# EAGLE design dc25-darknet-dialer (EAGLE 7.7.0)
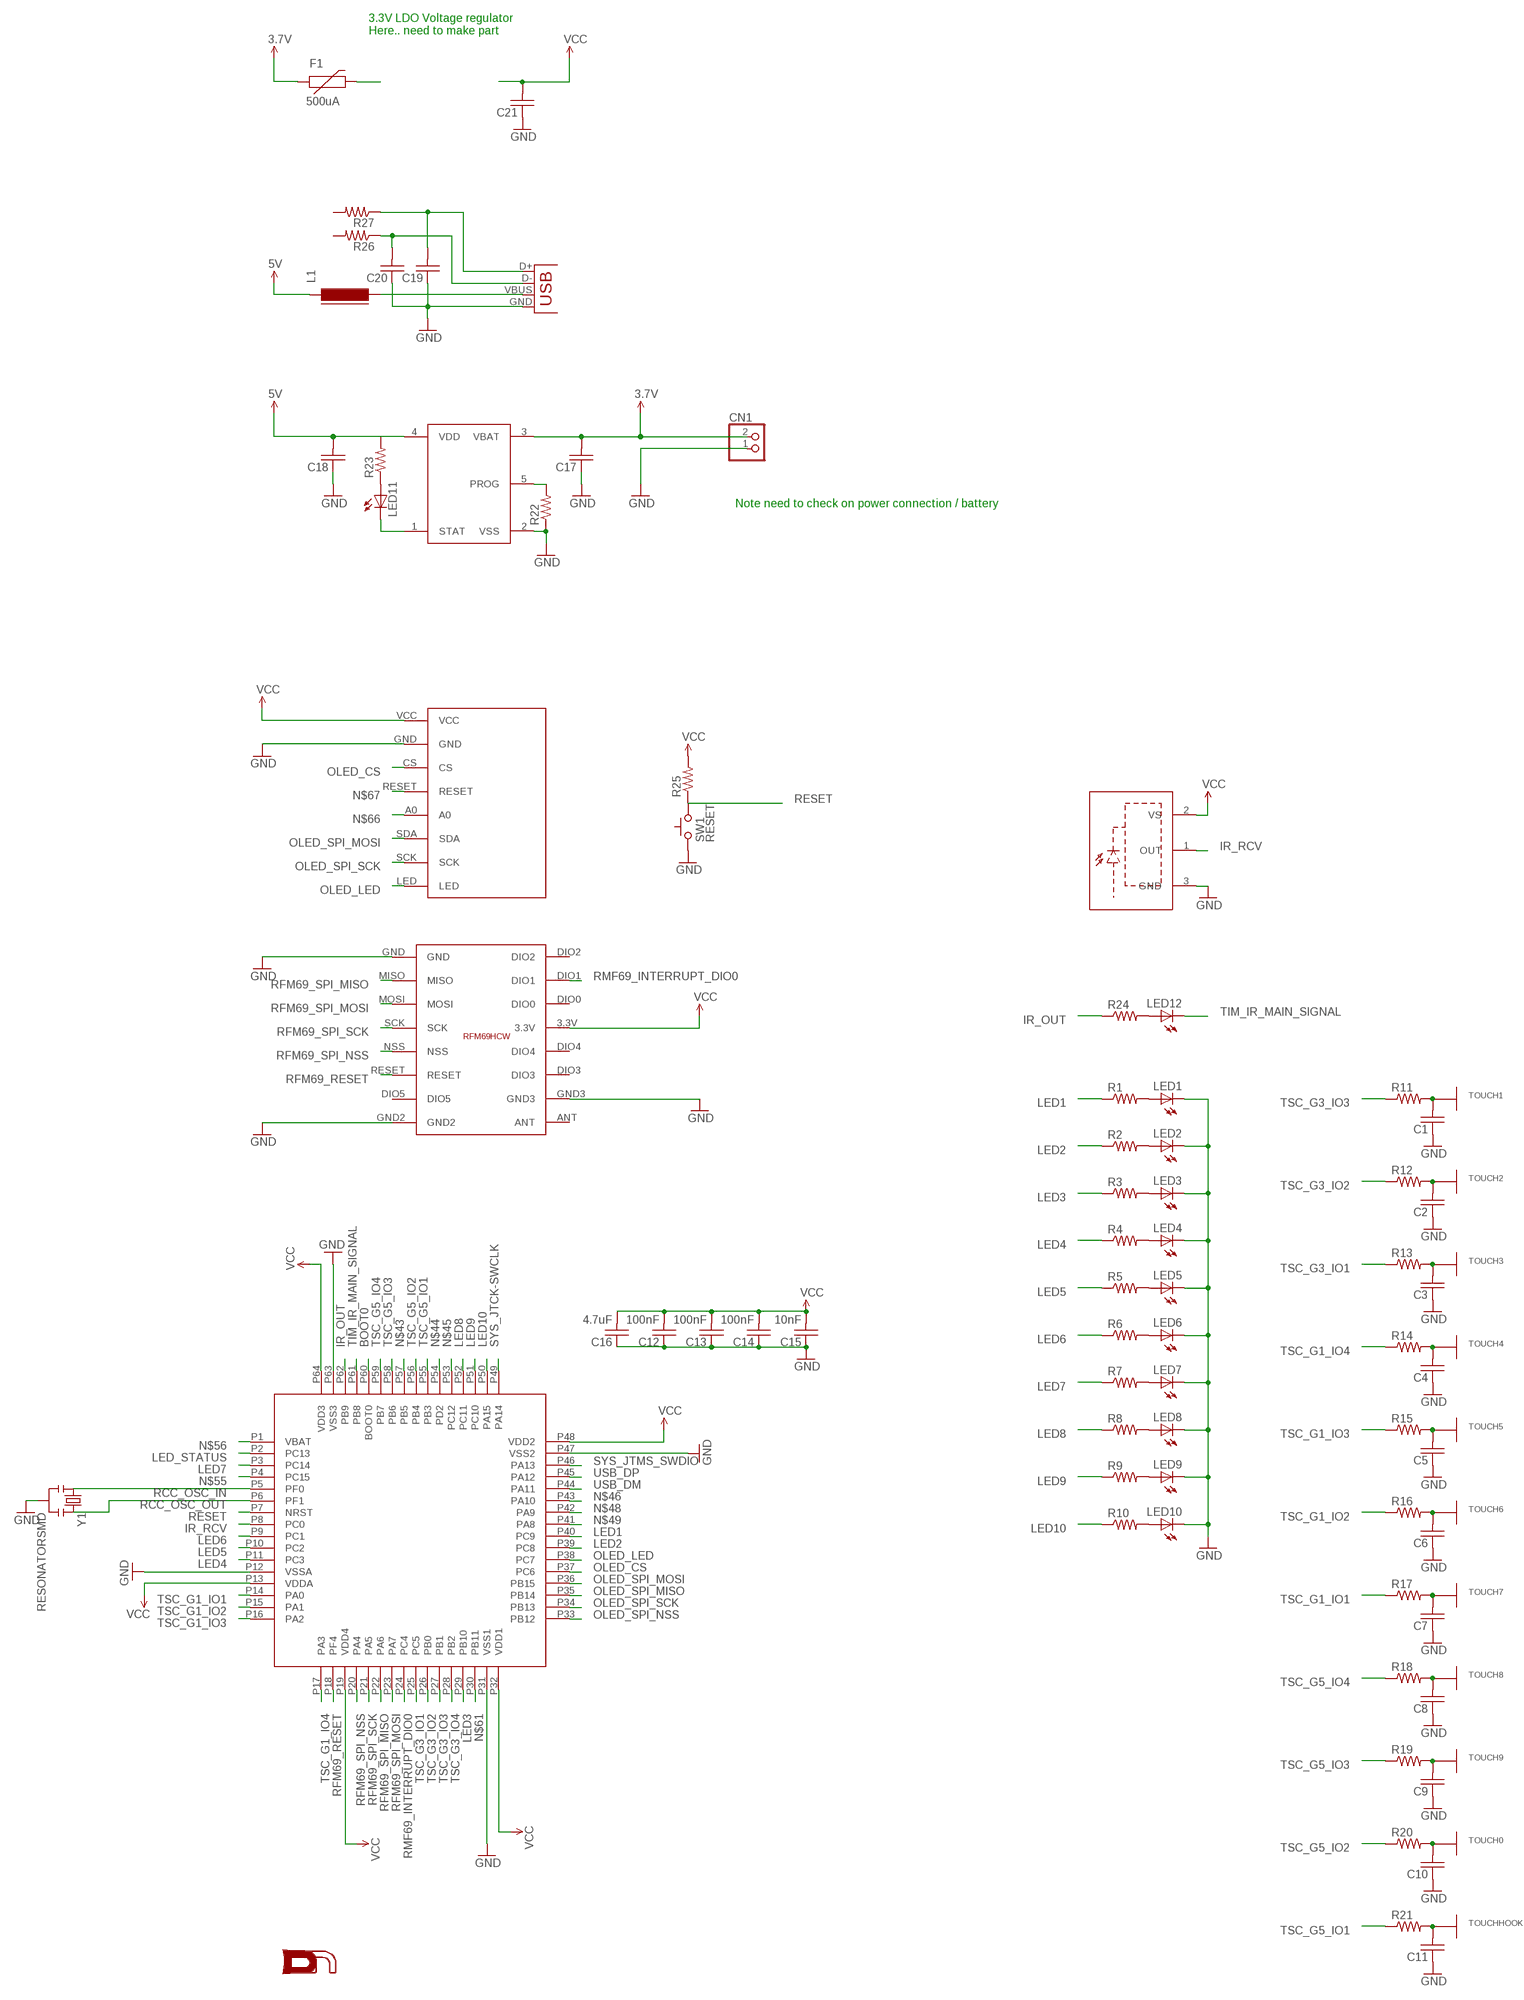
[diagram p0: schematic, sheet 1]

## Parts
C1  C-USC0603  [C0603]
C2  C-USC0603  [C0603]
C3  C-USC0603  [C0603]
C4  C-USC0603  [C0603]
C5  C-USC0603  [C0603]
C6  C-USC0603  [C0603]
C7  C-USC0603  [C0603]
C8  C-USC0603  [C0603]
C9  C-USC0603  [C0603]
C10  C-USC0603  [C0603]
C11  C-USC0603  [C0603]
C12  100nF  C-USC0603  [C0603]
C13  100nF  C-USC0603  [C0603]
C14  100nF  C-USC0603  [C0603]
C15  10nF  C-USC0603  [C0603]
C16  4.7uF  C-USC0603  [C0603]
C17  C-USC0603  [C0603]
C18  C-USC0603  [C0603]
C19  C-USC0603  [C0603]
C20  C-USC0603  [C0603]
C21  C-USC0603  [C0603]
CN1  JST_2PIN-THM-RA  [JST-PH-2-THM-RA]
F1  500uA  PTCSMD  [PTC-1206]
L1  FERRITE-0603  [FB603]
LED1  LEDREVERSEMOUNT  [GULLWING_LED]
LED2  LEDREVERSEMOUNT  [GULLWING_LED]
LED3  LEDREVERSEMOUNT  [GULLWING_LED]
LED4  LEDREVERSEMOUNT  [GULLWING_LED]
LED5  LEDREVERSEMOUNT  [GULLWING_LED]
LED6  LEDREVERSEMOUNT  [GULLWING_LED]
LED7  LEDREVERSEMOUNT  [GULLWING_LED]
LED8  LEDREVERSEMOUNT  [GULLWING_LED]
LED9  LEDREVERSEMOUNT  [GULLWING_LED]
LED10  LEDREVERSEMOUNT  [GULLWING_LED]
LED11  LED0603  [LED-0603]
LED12  LED5MM  [LED5MM]
R1  RESISTOR1206  [1206]
R2  RESISTOR1206  [1206]
R3  RESISTOR1206  [1206]
R4  RESISTOR1206  [1206]
R5  RESISTOR1206  [1206]
R6  RESISTOR1206  [1206]
R7  RESISTOR1206  [1206]
R8  RESISTOR1206  [1206]
R9  RESISTOR1206  [1206]
R10  RESISTOR1206  [1206]
R11  R-US_R0603  [R0603]
R12  R-US_R0603  [R0603]
R13  R-US_R0603  [R0603]
R14  R-US_R0603  [R0603]
R15  R-US_R0603  [R0603]
R16  R-US_R0603  [R0603]
R17  R-US_R0603  [R0603]
R18  R-US_R0603  [R0603]
R19  R-US_R0603  [R0603]
R20  R-US_R0603  [R0603]
R21  R-US_R0603  [R0603]
R22  R-US_R0603  [R0603]
R23  R-US_R0603  [R0603]
R24  R-US_0309/12  [0309/12]
R25  R-US_0309/12  [0309/12]
R26  R-US_R0603  [R0603]
R27  R-US_R0603  [R0603]
SW1  RESET  SWITCH_TACTILETACTILE-2PIN-NARROW  [TACTILE-2PIN-NARROW]
TOUCH0  CAP_TOUCH0  [CAP_TOUCH_PAD_0]
TOUCH1  CAP_TOUCH1  [CAP_TOUCH_PAD_1]
TOUCH2  CAP_TOUCH2  [CAP_TOUCH_PAD_2]
TOUCH3  CAP_TOUCH3  [CAP_TOUCH_PAD_3]
TOUCH4  CAP_TOUCH4  [CAP_TOUCH_PAD_4]
TOUCH5  CAP_TOUCH5  [CAP_TOUCH_PAD_5]
TOUCH6  CAP_TOUCH6  [CAP_TOUCH_PAD_6]
TOUCH7  CAP_TOUCH7  [CAP_TOUCH_PAD_7]
TOUCH8  CAP_TOUCH8  [CAP_TOUCH_PAD_8]
TOUCH9  CAP_TOUCH9  [CAP_TOUCH_PAD_9]
TOUCHHOOK  CAP_TOUCHHOOK  [CAP_TOUCH_PAD_HOOK]
U$1  DN_LOGO  [DN_LOGO]
U$2  STM32F302XC  [LQFP64]
U$11  DS21984E  [SOT23-5]
U$12  COLOR_LCD_MODULE  [COLOR_LCD_DISPLAY]
U$15  RFM69HCWRFN69HCWSMD  [16PIN-PCB-SMD]
U$17  SOP22  [IR-MODULE]
X1  USB-MICROB  [USB-MICROB]
Y1  RESONATORSMD  [RESONATOR-SMD]

## Nets
BOOT0: U$2.P60(BOOT0)
GND: C1.1 C2.1 C3.1 C4.1 C5.1 C6.1 C7.1 C8.1 C9.1 C10.1 C11.1 C12.1 C13.1 C14.1 C15.1 C16.1 C17.1 C18.1 C19.1 C20.1 C21.1 CN1.1 LED1.C LED2.C LED3.C LED4.C LED5.C LED6.C LED7.C LED8.C LED9.C LED10.C R22.1 SW1.P$2(C) U$2.P12(VSSA) U$2.P31(VSS1) U$2.P47(VSS2) U$2.P63(VSS3) U$11.2(VSS) U$12.GND U$15.GND U$15.GND2 U$15.GND3 U$17.3(GND) X1.GND Y1.2
IR_OUT: R24.1 U$2.P62(PB9)
IR_RCV: U$2.P8(PC0) U$17.1(OUT)
LED1: R1.1 U$2.P40(PC9)
LED2: R2.1 U$2.P39(PC8)
LED3: R3.1 U$2.P29(PB10)
LED4: R4.1 U$2.P11(PC3)
LED5: R5.1 U$2.P10(PC2)
LED6: R6.1 U$2.P9(PC1)
LED7: R7.1 U$2.P3(PC14)
LED8: R8.1 U$2.P52(PC11)
LED9: R9.1 U$2.P51(PC10)
LED10: R10.1 U$2.P50(PA15)
LED_STATUS: U$2.P2(PC13)
N$1: C1.2 R11.2 TOUCH1.PAD(TOUCH)
N$2: C2.2 R12.2 TOUCH2.PAD(TOUCH)
N$3: C3.2 R13.2 TOUCH3.PAD(TOUCH)
N$4: C4.2 R14.2 TOUCH4.PAD(TOUCH)
N$5: C5.2 R15.2 TOUCH5.PAD(TOUCH)
N$6: C6.2 R16.2 TOUCH6.PAD(TOUCH)
N$7: C7.2 R17.2 TOUCH7.PAD(TOUCH)
N$8: C8.2 R18.2 TOUCH8.PAD(TOUCH)
N$9: C9.2 R19.2 TOUCH9.PAD(TOUCH)
N$10: C10.2 R20.2 TOUCH0.PAD(TOUCH)
N$11: C11.2 R21.2 TOUCHHOOK.P$1(TOUCH)
N$12: LED1.A R1.2
N$13: LED2.A R2.2
N$14: LED3.A R3.2
N$15: LED4.A R4.2
N$16: LED5.A R5.2
N$17: LED6.A R6.2
N$18: LED7.A R7.2
N$19: LED8.A R8.2
N$20: LED9.A R9.2
N$21: LED10.A R10.2
N$22: R22.2 U$11.5(PROG)
N$23: LED12.A R24.2
N$24: LED11.A R23.1
N$25: LED11.C U$11.1(STAT)
N$26: C19.2 R27.1 X1.D+
N$27: C20.2 R26.1 X1.D-
N$28: L1.2 X1.VBUS
N$31: F1.2
N$43: U$2.P57(PB5)
N$44: U$2.P54(PD2)
N$45: U$2.P53(PC12)
N$46: U$2.P43(PA10)
N$48: U$2.P42(PA9)
N$49: U$2.P41(PA8)
N$55: U$2.P4(PC15)
N$56: U$2.P1(VBAT)
N$61: U$2.P30(PB11)
N$66: U$12.A0
N$67: U$12.RESET
OLED_CS: U$2.P37(PC6) U$12.CS
OLED_LED: U$2.P38(PC7) U$12.LED
OLED_SPI_MISO: U$2.P35(PB14)
OLED_SPI_MOSI: U$2.P36(PB15) U$12.SDA
OLED_SPI_NSS: U$2.P33(PB12)
OLED_SPI_SCK: U$2.P34(PB13) U$12.SCK
RCC_OSC_IN: U$2.P5(PF0) Y1.1
RCC_OSC_OUT: U$2.P6(PF1) Y1.3
RESET: R25.1 SW1.P$1(A) U$2.P7(NRST)
RFM69_RESET: U$2.P18(PF4) U$15.RESET
RFM69_SPI_MISO: U$2.P22(PA6) U$15.MISO
RFM69_SPI_MOSI: U$2.P23(PA7) U$15.MOSI
RFM69_SPI_NSS: U$2.P20(PA4) U$15.NSS
RFM69_SPI_SCK: U$2.P21(PA5) U$15.SCK
RMF69_INTERRUPT_DIO0: U$2.P24(PC4) U$15.DIO1
SYS_JTCK-SWCLK: U$2.P49(PA14)
SYS_JTMS_SWDIO: U$2.P46(PA13)
TIM_IR_MAIN_SIGNAL: LED12.K(C) U$2.P61(PB8)
TSC_G1_IO1: R17.1 U$2.P14(PA0)
TSC_G1_IO2: R16.1 U$2.P15(PA1)
TSC_G1_IO3: R15.1 U$2.P16(PA2)
TSC_G1_IO4: R14.1 U$2.P17(PA3)
TSC_G3_IO1: R13.1 U$2.P25(PC5)
TSC_G3_IO2: R12.1 U$2.P26(PB0)
TSC_G3_IO3: R11.1 U$2.P27(PB1)
TSC_G3_IO4: U$2.P28(PB2)
TSC_G5_IO1: R21.1 U$2.P55(PB3)
TSC_G5_IO2: R20.1 U$2.P56(PB4)
TSC_G5_IO3: R19.1 U$2.P58(PB6)
TSC_G5_IO4: R18.1 U$2.P59(PB7)
USB_DM: U$2.P44(PA11)
USB_DP: U$2.P45(PA12)
VCC: C12.2 C13.2 C14.2 C15.2 C16.2 C21.2 R25.2 U$2.P13(VDDA) U$2.P19(VDD4) U$2.P32(VDD1) U$2.P48(VDD2) U$2.P64(VDD3) U$12.VCC U$15.3.3V U$17.2(VS)
VCC0: C18.2 L1.1 R23.2 U$11.4(VDD) ; supply symbol labelled 5V
VCC1: C17.2 CN1.2 F1.1 U$11.3(VBAT) ; supply symbol labelled 3.7V
Unconnected: R26.2 R27.2 U$15.ANT U$15.DIO0 U$15.DIO2 U$15.DIO3 U$15.DIO4 U$15.DIO5

## Notes on the sheet
- 3.3V LDO Voltage regulator
  Here.. need to make part
- Note need to check on power connection / battery

## Library data of the parts
C1-C21 = SYNShop:C-US: CAPACITOR, American symbol
CN1 = adafruit:JST_2PIN: JST 2-Pin Connectors of various flavors SMT-RA (S2B-PH-SM4) 4UConnector #17311 SMT (B2B-PH-SM4) THM-RA (S2B-PH) THM (B2B-PH)
F1 = SparkFun:PTC: Resettable Fuse PTC Resettable Fuse. Spark Fun Electronics SKU : COM-08357
L1 = dp_devices:FERRITE: Ferrite bead in various packages
LED1-LED12 = SYNShop:LED: LEDs Standard schematic elements and footprints for 5mm, 3mm, 1206, and 0603 sized LEDs. 5mm - Spark Fun Electronics SKU : COM-00529 (and others)
R1-R10 = SYNShop:RESISTOR: Resistor Basic schematic elements and footprints for 0603, 1206, and PTH resistors.
R11-R27 = SYNShop:R-US_: RESISTOR, American symbol
SW1 = SYNShop:SWITCH_TACTILE
TOUCH0 TOUCH1-TOUCH9 TOUCHHOOK = darknet_parts_library:CAP_TOUCH
U$1 = SYNShop:DN_LOGO
U$2 = darknet_parts_library:STM32F302XC
U$11 = darknet_parts_library:DS21984E
U$12 = darknet_parts_library:COLOR_LCD_MODULE
U$15 = SYNShop:RFM69HCW
U$17 = SYNShop:SOP22
X1 = SYNShop:USB: USB Connectors USB-B-PTH is fully proven SKU : PRT-00139 USB-miniB is fully proven SKU : PRT-00587 USB-A-PCB is untested. USB-A-H is throughly reviewed, but untested. Spark Fun Electronics SKU : PRT-00437 USB-B-SMT is throughly reviewed, but untested. Needs silkscreen touching up. USB-A-S has not been used/tested USB-MB-H has not been used/tested
Y1 = SparkFun:RESONATOR: Resonator Small SMD resonator. This is the itty bitty 10/20MHz resonators with built in caps. CSTCE10M0G55 and CSTCE20M0V53. Footprint has been reviewed closely but hasn't been tested yet.

## Board
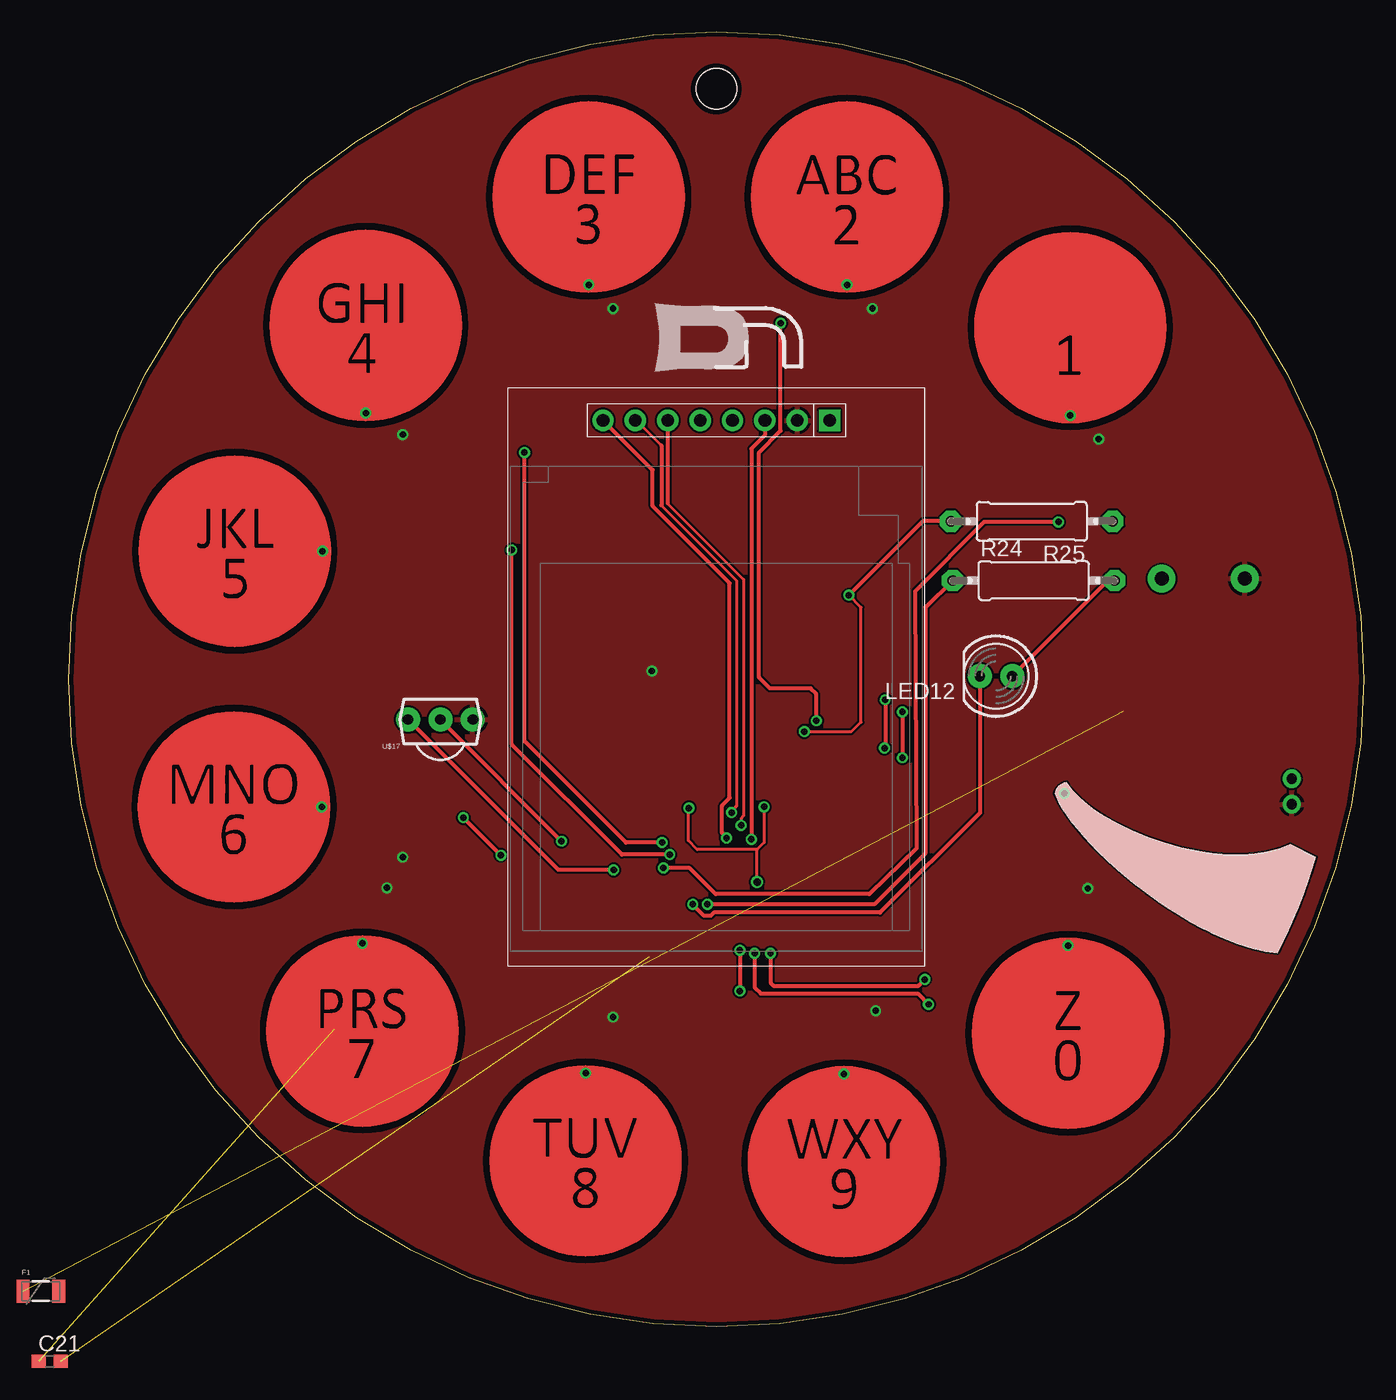
[diagram p1: board, top side]
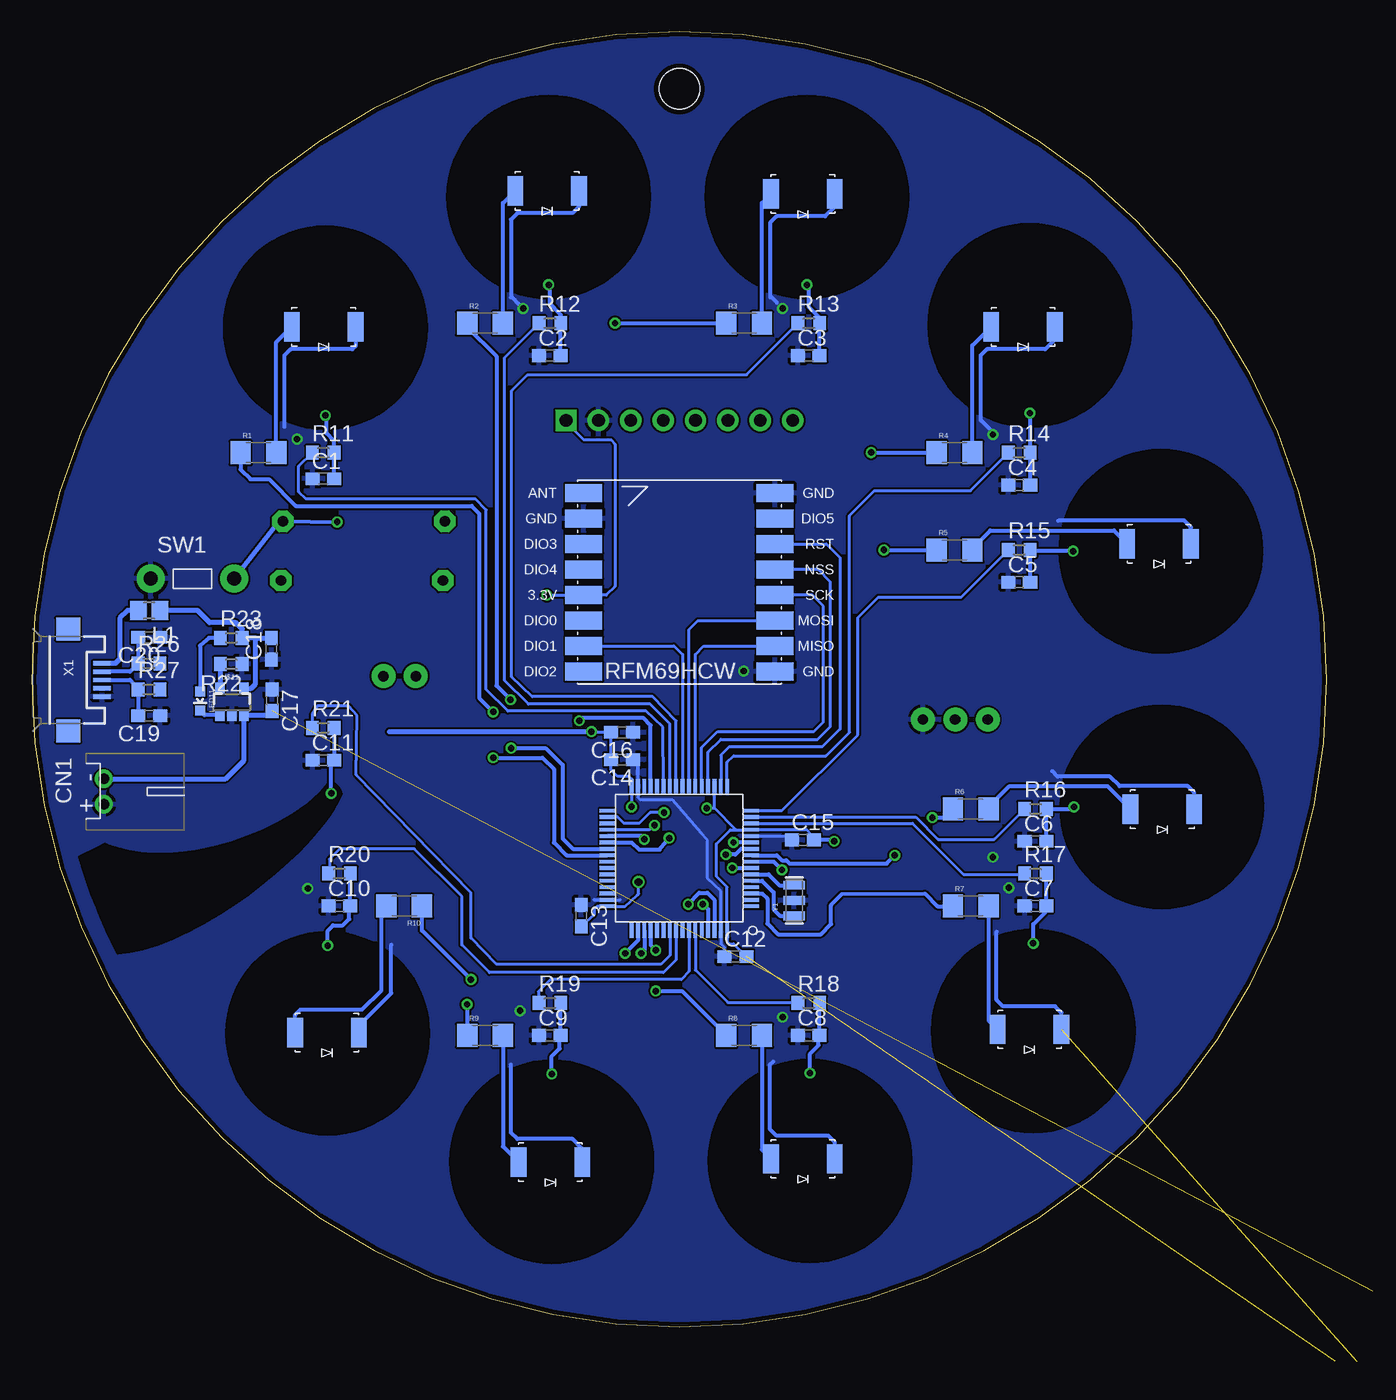
[diagram p2: board, bottom side, seen from below]

Size 101.6 x 101.6 mm. Coordinates in mm from the lower left corner, seen from the top.
Outline: 50.8,101.6 arc-180 50.8,0 arc-180 50.8,101.6
Copper layers (1*16): Top 0.0356mm / dielectric 1.5011mm / Bottom 0.0356mm
Design rules "oshpark-2layer": minimum track width 6mil, minimum drill 13mil, track to track 6mil, track to pad 6mil, pad to pad 6mil, via to via 6mil, smd to smd 6mil, copper to edge 15mil, drill to drill 6mil, minimum pad ring 7mil, minimum via ring 7mil, stop-mask expansion 2.5mil, vias tented up to drill 0mil, thermal gap 10mil
Holes 3.2 mm at 50.8,97.12

### Footprints (pad centres in the part's own frame; a part is rotated, then mirrored left to right if it is on the bottom)
C0603 = smd 1.1 x 1: 1 -0.85,0; 2 0.85,0
JST-PH-2-THM-RA = drill 0.8 pad 1.422: 1 1,0; 2 -1,0
PTC-1206 = smd 1 x 1.8: 1 -1.4,0; 2 1.4,0
FB603 = smd 1.3 x 1.5: 1 -0.85,0; 2 0.85,0
GULLWING_LED = smd 1.245 x 2.3: A 5,-1.5; C 0,-1.5
LED-0603 = smd 0.8 x 0.8: A 0,-0.75; C 0,0.75
LED5MM = drill 0.813 pad 1.88: A -1.27,0; K 1.27,0
1206 = smd 1.6 x 1.8: 1 -1.4,0; 2 1.4,0
R0603 = smd 1 x 1.1: 1 -0.85,0; 2 0.85,0
0309/12 = drill 0.813 pad 1.676 octagon: 1 -6.35,0; 2 6.35,0
TACTILE-2PIN-NARROW = drill 1.1 pad 2.184: P$1 3.264,0; P$2 -3.264,0
CAP_TOUCH_PAD_0 = drill 0.5: PAD 0,6.881
CAP_TOUCH_PAD_1 = drill 0.5: PAD 0,-6.881
CAP_TOUCH_PAD_2 = drill 0.5: PAD 0,-6.881
CAP_TOUCH_PAD_3 = drill 0.5: PAD 0,-6.881
CAP_TOUCH_PAD_4 = drill 0.5: PAD 0,-6.881
CAP_TOUCH_PAD_5 = drill 0.5: PAD 6.881,0
CAP_TOUCH_PAD_6 = drill 0.5: PAD 6.881,0
CAP_TOUCH_PAD_7 = drill 0.5: PAD 0,6.881
CAP_TOUCH_PAD_8 = drill 0.5: PAD 0,6.881
CAP_TOUCH_PAD_9 = drill 0.5: PAD 0,6.881
CAP_TOUCH_PAD_HOOK = drill 0.5: P$1 -8,6.3
LQFP64 = smd 1.2 x 0.3: P1 -5.65,3.75; P2 -5.65,3.25; P3 -5.65,2.75; P4 -5.65,2.25; P5 -5.65,1.75; P6 -5.65,1.25; P7 -5.65,0.75; P8 -5.65,0.25; P9 -5.65,-0.25; P10 -5.65,-0.75; P11 -5.65,-1.25; P12 -5.65,-1.75; P13 -5.65,-2.25; P14 -5.65,-2.75; P15 -5.65,-3.25; P16 -5.65,-3.75; P33 5.65,-3.75; P34 5.65,-3.25; P35 5.65,-2.75; P36 5.65,-2.25; P37 5.65,-1.75; P38 5.65,-1.25; P39 5.65,-0.75; P40 5.65,-0.25; P41 5.65,0.25; P42 5.65,0.75; P43 5.65,1.25; P44 5.65,1.75; P45 5.65,2.25; P46 5.65,2.75; P47 5.65,3.25; P48 5.65,3.75 | smd 0.3 x 1.2: P17 -3.75,-5.65; P18 -3.25,-5.65; P19 -2.75,-5.65; P20 -2.25,-5.65; P21 -1.75,-5.65; P22 -1.25,-5.65; P23 -0.75,-5.65; P24 -0.25,-5.65; P25 0.25,-5.65; P26 0.75,-5.65; P27 1.25,-5.65; P28 1.75,-5.65; P29 2.25,-5.65; P30 2.75,-5.65; P31 3.25,-5.65; P32 3.75,-5.65; P49 3.75,5.65; P50 3.25,5.65; P51 2.75,5.65; P52 2.25,5.65; P53 1.75,5.65; P54 1.25,5.65; P55 0.75,5.65; P56 0.25,5.65; P57 -0.25,5.65; P58 -0.75,5.65; P59 -1.25,5.65; P60 -1.75,5.65; P61 -2.25,5.65; P62 -2.75,5.65; P63 -3.25,5.65; P64 -3.75,5.65
SOT23-5 = smd 0.75 x 0.9: 1 -0.95,-1; 2 0,-1; 3 0.95,-1; 4 0.95,1.1; 5 -0.95,1.1
COLOR_LCD_DISPLAY = drill 1 pad 1.676: A0 -1.27,0; CS 3.81,0; GND 6.35,0; LED -8.89,0; RESET 1.27,0; SCK -6.35,0; SDA -3.81,0 | drill 1 pad 1.676 square: VCC 8.89,0
16PIN-PCB-SMD = smd 2.9 x 1.422: 3.3V 7.5,1; ANT 7.5,-7; DIO0 7.5,3; DIO1 7.5,5; DIO2 7.5,7; DIO3 7.5,-3; DIO4 7.5,-1; DIO5 -7.5,-5; GND -7.5,7; GND2 -7.5,-7; GND3 7.5,-5; MISO -7.5,5; MOSI -7.5,3; NSS -7.5,-1; RESET -7.5,-3; SCK -7.5,1
IR-MODULE = drill 0.813 pad 1.88: 1 -2.54,0; 2 0,0; 3 2.54,0
USB-MICROB = smd 0.35 x 1.4: D+ 0,2.65; D- -0.65,2.65; GND 1.3,2.65; ID 0.65,2.65; VBUS -1.3,2.65 | smd 1.8 x 1.9: MT1 -4,0; MT2 4,0
RESONATOR-SMD = smd 0.7 x 1.7: 1 -1.2,0; 2 0,0; 3 1.2,0

### Placement (x,y rotation side)
C1  78.74,66.54 0 bottom
C2  60.96,76.2 0 bottom
C3  40.64,76.2 0 bottom
C4  24.13,66.04 0 bottom
C5  24.13,58.42 0 bottom
C6  22.86,38.1 0 bottom
C7  22.86,33.02 0 bottom
C8  40.64,22.86 0 bottom
C9  60.96,22.86 0 bottom
C10  77.47,33.02 0 bottom
C11  78.74,44.45 0 bottom
C12  46.4,29.05 0 bottom
C13  58.5,32.25 270 bottom
C14  55.3,44.5 180 bottom
C15  41.1,38.2 0 bottom
C16  55.3,46.65 180 bottom
C17  82.75,49.15 270 bottom
C18  82.8,53.2 90 bottom
C19  92.4,47.95 180 bottom
C20  92.4,54.1 180 bottom
C21  -1.5,-2.7 0 top
CN1  95.95,42 270 bottom
F1  -2.2,2.8 0 top
L1  92.4,56.2 180 bottom
LED1  76.2,76.96 180 bottom
LED2  58.67,87.63 180 bottom
LED3  38.61,87.38 180 bottom
LED4  21.34,76.96 180 bottom
LED5  10.67,59.94 180 bottom
LED6  10.41,39.12 180 bottom
LED7  20.83,21.84 180 bottom
LED8  38.61,11.68 180 bottom
LED9  58.42,11.43 180 bottom
LED10  75.95,21.59 180 bottom
LED11  88.4,49.1 180 bottom
LED12  72.75,51.05 180 top
R1  83.82,68.58 0 bottom
R2  66.04,78.74 0 bottom
R3  45.72,78.74 0 bottom
R4  29.21,68.58 0 bottom
R5  29.21,60.96 0 bottom
R6  27.94,40.64 0 bottom
R7  27.94,33.02 0 bottom
R8  45.72,22.86 0 bottom
R9  66.04,22.86 0 bottom
R10  72.39,33.02 180 bottom
R11  78.74,68.58 0 bottom
R12  60.96,78.74 0 bottom
R13  40.64,78.74 0 bottom
R14  24.13,68.58 0 bottom
R15  24.13,60.96 0 bottom
R16  22.86,40.64 0 bottom
R17  22.86,35.56 0 bottom
R18  40.64,25.4 0 bottom
R19  60.96,25.4 0 bottom
R20  77.47,35.56 0 bottom
R21  78.74,46.99 0 bottom
R22  85.95,52 180 bottom
R23  85.95,54.05 0 bottom
R24  75.7,58.55 0 top
R25  75.55,63.2 180 top
R26  92.4,52.05 0 bottom
R27  92.4,50 0 bottom
SW1  89,58.7 0 bottom
TOUCH0  78.39,23.03 0 top
TOUCH1  78.57,78.39 0 top
TOUCH2  61.05,88.64 0 top
TOUCH3  40.79,88.64 0 top
TOUCH4  23.3,78.57 0 top
TOUCH5  13.02,60.85 0 top
TOUCH6  12.96,40.79 0 top
TOUCH7  23.03,23.21 0 top
TOUCH8  40.55,13.02 0 top
TOUCH9  60.81,12.96 0 top
TOUCHHOOK  86.11,35.56 0 top
U$1  45.59,75.03 0 top
U$2  50.8,36.75 180 bottom
U$11  85.9,49 0 bottom
U$12  50.8,71.12 0 top
U$15  50.8,58.42 180 bottom
U$17  29.15,47.65 0 top
X1  98.75,50.75 270 bottom
Y1  41.8,33.45 90 bottom

### Tracks (layer width: path | path; a pad name or v marks a point on that pad's centre or on a via)
GND  (via drill 0.5)  (1 unrouted)
  Bottom 0.254: U$2.P47 57.5,33.52 57.5,33.5 55.45,33.5 | U$2.P12 42.1,38.5 C15.1 | 54.05,43.35 U$2.P31 54.05,41.55 53.85,41.35 51.35,41.35 49.1,38.75 48.6,38.2 48.6,35.2 47.55,34.2 U$2.P63 47.55,30.05 47.25,29.75 C12.1
  Bottom 0.305: LED10.C 75.95,23.62 73.41,26.16 73.41,29.97 | LED9.C 58.42,13.97 59.18,14.73 63.5,14.73 64.01,15.24 64.01,20.57 | LED8.C 38.61,14.48 39.12,14.99 43.18,14.99 43.69,15.49 43.69,20.57 43.43,20.83 | LED7.C 20.83,24.64 21.34,25.15 25.4,25.15 25.91,25.65 25.91,30.99 | LED6.C 10.41,41.91 10.92,42.42 16.26,42.42 17.02,43.18 21.13,43.18 21.55,43.6 | LED5.C 10.67,62.74 11.18,63.25 21.08,63.25 | LED4.C 21.34,77.47 22.1,76.71 26.67,76.71 27.18,76.2 27.18,71.12 27.12,71.12 26.35,70.35 | LED3.C 38.61,87.88 39.37,87.12 43.18,87.12 43.69,86.61 43.69,80.77 43.57,80.77 43.15,80.35 | LED2.C 58.67,87.88 59.18,87.38 63.5,87.38 64.01,86.87 64.01,80.77 63.92,80.77 63.4,80.25 | LED1.C 76.2,76.96 76.45,76.71 81.28,76.71 81.79,76.2 81.79,70.61 | 54.05,43.35 54.05,44.1 C14.1
  other vias: 45.75,51.45 26.2,36.85 63.05,79.9 42.7,79.9 26.2,70 24.95,34.45 42.7,24.3 63.3,24.8 79.95,34.4 80.8,69.65
  pour Top: 0,50.8 arc-90 50.8,101.6 arc-90 101.6,50.8 arc-90 50.8,0 arc-90
  pour Bottom: 50.8,101.6 arc90 0,50.8 arc90 50.8,0 arc90 101.6,50.8 arc90
IR_OUT  (via drill 0.5)
  Top 0.305: R24.1 67.2,56.45 67.2,37.15 63.2,33.15 v50.1,33.15
  Bottom 0.305: v50.1,33.15 50.1,33.2 49.25,34.05 48.6,34.05 48.05,33.5 U$2.P62
IR_RCV  (via drill 0.5)
  Top 0.305: v42.75,35.85 38.41,35.85 U$17.1
  Bottom 0.305: U$2.P8 43.4,36.5 v42.75,35.85
LED1  (via drill 0.5)
  Top 0.305: v65.4,48.25 v65.4,44.65
  Bottom 0.305: R1.1 85.22,67.27 84.45,66.5 83,66.5 80.9,64.4 67.1,64.4 66.5,63.8 66.5,49.35 v65.4,48.25 | v65.4,44.65 61.55,44.65 60.65,43.75 60.65,38 59.65,37 U$2.P40
LED2  (via drill 0.5)
  Top 0.305: v64.05,49.2 64.05,45.55 v64,45.4
  Bottom 0.305: R2.1 67.44,78.44 65.15,76.15 65.15,50.3 v64.05,49.2 | v64,45.4 61.3,45.4 59.95,44.1 59.95,38.3 59.15,37.5 U$2.P39
LED3  (via drill 0.5)
  Top 0.305: v58.65,47.55 58.65,49.65 58.2,50.1 55,50.1 54.15,50.95 54.15,68.6 55.85,70.3 v55.85,78.75
  Bottom 0.305: U$2.P29 53.05,47.2 53.6,47.75 58.5,47.75 v58.65,47.55 | v55.85,78.75 R3.1
LED4  (via drill 0.5)
  Top 0.305: v46.55,38 43.7,38 35.75,45.95 v35.75,68.6
  Bottom 0.305: U$2.P11 v46.55,38 | v35.75,68.6 30.63,68.6 R4.1
LED5  (via drill 0.5)
  Top 0.305: v47.15,37.05 43.4,37.05 34.75,45.7 v34.75,60.95
  Bottom 0.305: U$2.P10 45.95,37.5 46.4,37.05 v47.15,37.05 | v34.75,60.95 R5.1
LED6  (via drill 0.5)
  Top 0.305: v33.9,37 v30.95,39.95
  Bottom 0.305: U$2.P9 43.15,37 42.75,36.6 42.4,36.6 42.15,36.35 34.55,36.35 v33.9,37 | v30.95,39.95 30.03,39.95 R6.1
LED7
  Bottom 0.305: U$2.P3 44.3,34 43.9,33.6 43.9,31.65 43.05,30.8 39.7,30.8 38.9,31.6 38.9,33.1 38.05,33.95 31.55,34 30.55,33 29.36,33 R7.1
LED8  (via drill 0.5)
  Top 0.305: v52.65,29.55 v52.65,26.35
  Bottom 0.305: U$2.P52 53.05,29.95 v52.65,29.55 | v52.65,26.35 50.61,26.35 R8.1
LED9  (via drill 0.5)
  Top 0.305: v53.8,29.3 53.8,26.65 54.3,26.15 66.6,26.15 v67.45,25.3
  Bottom 0.305: U$2.P51 53.55,29.55 v53.8,29.3 | v67.45,25.3 R9.1
LED10  (via drill 0.5)
  Top 0.305: v55.05,29.3 55.05,27 55.3,26.75 66.65,26.75 v67.15,27.25
  Bottom 0.305: U$2.P50 54.05,30.3 v55.05,29.3 | v67.15,27.25 71,31.1 R10.1
N$1
  Bottom 0.305: C1.2 R11.2 77.89,69.51 78.49,70.1 78.49,71.42 TOUCH1.PAD
N$2
  Bottom 0.305: C2.2 R12.2 60.11,79.41 60.96,80.26 60.96,81.67 TOUCH2.PAD
N$3
  Bottom 0.305: C3.2 R13.2 39.79,79.16 40.64,80.01 40.64,81.61 TOUCH3.PAD
N$4
  Bottom 0.305: TOUCH4.PAD 23.3,68.6 R14.2 C4.2
N$5
  Bottom 0.305: C5.2 R15.2 23.17,60.85 TOUCH5.PAD
N$6
  Bottom 0.305: C6.2 R16.2 19.99,40.64 TOUCH6.PAD
N$7
  Bottom 0.305: TOUCH7.PAD 23.03,31.58 22.1,32.51 22.1,32.93 C7.2 R17.2
N$8
  Bottom 0.305: TOUCH8.PAD 40.55,21.43 39.88,22.1 39.88,22.77 C8.2 R18.2
N$9
  Bottom 0.305: TOUCH9.PAD 60.81,21.23 60.2,21.84 60.2,22.77 C9.2 R19.2
N$10
  Bottom 0.305: TOUCH0.PAD 78.39,31.08 77.98,31.5 77.22,31.5 76.71,32 76.71,32.93 C10.2 R20.2
N$11
  Bottom 0.305: TOUCHHOOK.P$1 78.11,44.23 C11.2 R21.2
N$12
  Bottom 0.305: R1.2 82.42,77.24 LED1.A
N$13
  Bottom 0.305: R2.2 64.64,88.16 LED2.A
N$14
  Bottom 0.305: R3.2 44.32,88.16 LED3.A
N$15
  Bottom 0.305: R4.2 27.81,76.99 LED4.A
N$16
  Bottom 0.305: R5.2 27.81,61.09 26.42,62.48 16.71,62.48 LED5.A
N$17
  Bottom 0.305: R6.2 26.54,40.77 24.89,42.42 17.22,42.42 LED6.A
N$18
  Bottom 0.305: R7.2 26.54,24.06 LED7.A
N$19
  Bottom 0.305: R8.2 44.32,13.9 LED8.A
N$20
  Bottom 0.305: R9.2 64.64,14.15 LED9.A
N$21
  Bottom 0.305: LED10.A 80.95,24.46 80.52,24.89 75.69,24.89 74.17,26.42 74.17,32.64 R10.2
N$22
  Bottom 0.406: R22.2 U$11.5
N$23
  Top 0.305: R24.2 81.47,58.5 LED12.A
N$24
  Bottom 0.305: R23.1 87.7,54.05 88.4,53.45 LED11.A
N$25
  Bottom 0.305: U$11.1 88.05,48 LED11.C
N$26
  Bottom 0.305: X1.D+ 93.9,50.75 R27.1 C19.2
N$27
  Bottom 0.305: X1.D- 93.9,51.4 R26.1 C20.2
N$28
  Bottom 0.406: L1.2 94.1,56.2 94.7,55.6 94.7,52.4 95.05,52.05 X1.VBUS
OLED_CS  (via drill 0.5)
  Top 0.305: U$12.CS 54.61,69.96 53.55,68.9 v53.55,38.25
  Bottom 0.305: v53.55,38.25 53.6,38.35 53.75,38.5 U$2.P37
OLED_LED  (via drill 0.5)
  Top 0.305: v51.6,38.35 51.6,38.4 51.25,38.75 51.25,40.9 51.85,41.5 51.85,58.35 45.8,64.4 45.8,67.23 U$12.LED
  Bottom 0.305: U$2.P38 54.55,38 53.95,37.45 52.35,37.45 v51.6,38.35
OLED_SPI_MOSI  (via drill 0.5)
  Top 0.254: 46.99,64.61 52.95,58.65 52.95,40.1 52.75,39.85 v52.75,39.35
  Top 0.305: U$12.SDA 46.99,64.61
  Bottom 0.254: v52.75,39.35 52.8,39.35 53.15,39 U$2.P36
OLED_SPI_SCK  (via drill 0.5)
  Top 0.254: U$12.SCK 44.53,71.12 46.5,69.15 | 46.5,64.45 52.4,58.55 52.4,40.85 v52,40.35
  Top 0.305: 46.5,69.15 46.5,64.45
  Bottom 0.254: v52,40.35 53.1,40.35 53.95,39.5 55.15,39.5 55.65,40 U$2.P34
RCC_OSC_IN
  Bottom 0.305: U$2.P5 44.3,35 43.4,34.1 43.4,32.75 42.9,32.25 Y1.1
RCC_OSC_OUT
  Bottom 0.305: U$2.P6 43.8,35.5 42.95,34.65 Y1.3
RESET  (via drill 0.5)
  Top 0.305: v77.65,63.15 71.8,63.15 66.4,57.7 66.5,37.55 62.8,33.95 50.75,33.95 48.7,36 v46.65,36
  Bottom 0.305: R25.1 v77.65,63.15 | v46.65,36 U$2.P7
  Bottom 0.406: R25.1 82.19,63.2 SW1.P$1
RFM69_RESET
  Bottom 0.254: U$15.RESET 39.27,61.42 38.2,60.35 38.2,46.9 39.6,45.5 46.9,45.5 47.55,44.85 U$2.P18
RFM69_SPI_MISO
  Bottom 0.254: U$2.P22 49.55,52.75 48.9,53.4 43.32,53.4 U$15.MISO
RFM69_SPI_MOSI
  Bottom 0.254: U$2.P23 50.05,54.7 49.35,55.4 43.32,55.4 U$15.MOSI
RFM69_SPI_NSS
  Bottom 0.254: U$2.P20 48.55,45.1 47.55,46.1 39.95,46.1 38.95,47.1 38.95,58.45 39.9,59.4 43.28,59.4 U$15.NSS
RFM69_SPI_SCK
  Bottom 0.254: U$2.P21 49.05,45.45 47.8,46.7 40.25,46.7 39.5,47.45 39.5,56.55 40.35,57.4 43.28,57.4 U$15.SCK
RMF69_INTERRUPT_DIO0
  Bottom 0.254: U$15.DIO1 51.22,53.42 50.55,52.75 U$2.P24
TIM_IR_MAIN_SIGNAL  (via drill 0.5)
  Top 0.305: LED12.K 71.48,40.33 63.65,32.5 50.6,32.5 50.35,32.25 49.85,32.25 v48.95,33.15
  Bottom 0.305: v48.95,33.15 48.55,32.75 U$2.P61
TSC_G1_IO1
  Bottom 0.254: U$2.P14 32.5,39.5 28.5,35.5 23.77,35.5 R17.1
TSC_G1_IO2
  Bottom 0.254: U$2.P15 32.25,40 30.5,38.25 26.1,38.25 R16.1
TSC_G1_IO3
  Bottom 0.254: U$2.P16 42.75,40.5 36.8,46.45 36.8,55.65 35.2,57.25 28.69,57.25 R15.1
TSC_G1_IO4
  Bottom 0.254: U$2.P17 47.05,44.3 46.55,44.8 39.3,44.8 37.45,46.65 37.45,63.65 35.5,65.6 27.96,65.6 R14.1
TSC_G3_IO1
  Bottom 0.254: U$2.P25 51.05,47.55 52.9,49.45 62.35,49.45 63.95,51 63.95,73.45 62.7,74.7 45.53,74.7 R13.1
TSC_G3_IO2
  Bottom 0.254: U$2.P26 51.55,47.3 53.1,48.85 62.65,48.85 64.5,50.7 64.5,76.05 R12.1
TSC_G3_IO3
  Bottom 0.254: U$2.P27 52.1,47.05 53.4,48.3 64.25,48.3 65.95,50 65.95,64.1 66.8,64.95 80.1,64.95 80.65,65.5 80.65,67.52 R11.1
TSC_G5_IO1
  Bottom 0.254: U$2.P55 51.55,29.15 52.25,28.45 65.15,28.45 67.15,30.5 67.15,34.05 76.15,43.3 76.1,47.95 76.75,48.7 79.2,48.7 79.6,48.05 R21.1
TSC_G5_IO2
  Bottom 0.254: U$2.P56 51.05,28.8 52.05,27.8 65.7,27.8 67.85,29.95 67.85,33.75 71.6,37.5 77.45,37.5 78.25,36.7 78.25,35.63 R20.1
TSC_G5_IO3
  Bottom 0.254: R19.1 61.85,25.44 61.85,26.3 60.9,27.25 50.65,27.25 50.05,27.9 U$2.P58
TSC_G5_IO4
  Bottom 0.254: R18.1 41.54,25.45 47,25.45 49.55,28 U$2.P59
VCC  (via drill 0.5, 0.5 pad 0.25, 0.6 pad 0.25)  (1 unrouted)
  Top 0.254: v57.7,46.7 61.4,46.7 62.15,47.45 62.15,56.45 v61.2,57.4 | v54.55,40.8 54.55,38 54,37.45 | 54,37.45 49.3,37.45 48.6,38.15 48.6,40.4 v48.65,40.7 | v54,34.9 54,37.45
  Top 0.305: R25.2 67,63.2 v61.2,57.4 | U$17.2 29.15,47.6 v38.65,38.1
  Bottom 0.254: 46.35,39 46.8,39 47.9,37.9 47.9,35.35 47.05,34.5 U$2.P64 47.05,30.25 46.85,30.05 46.55,30.05 C12.2 | 46.35,39 U$2.P13 40.8,39 40.45,38.6 C15.2 | U$12.VCC 59.69,70.99 58.3,69.6 56.15,69.6 | 56.15,69.6 55.85,69.25 55.85,58.1 56.55,57.4 58.28,57.4 U$15.3.3V 58.32,57.4 v61.2,57.4 | C13.2 57.5,32.3 57.5,32.75 57.25,33 U$2.P48 55.05,33 54.1,33.9 54,34 v54,34.9 | 56.15,69.6 56.13,69.6 | v57.7,46.7 57.6,46.65 C16.2 C14.2 56.15,43.7 55.65,43.2 54.75,43.2 54.55,43 U$2.P32 v54.55,40.8 | 46.35,39 48.05,40.7 | 48.05,40.7 U$2.P19 | v48.65,40.7 48.05,40.7
  Bottom 0.305: v38.65,38.1 38.75,38.1 38.85,38.2 C15.2
  Bottom 0.406: 73.55,46.7 v57.7,46.7
VCC0
  Bottom 0.406: U$11.4 84.4,50.1 84.05,50.45 84.05,54.05 | 84.05,54.05 R23.2 85.1,54.75 85.6,55.25 87.65,55.25 88.6,56.2 L1.1 | 84.05,54.05 C18.2
VCC1  (1 unrouted)
  Bottom 0.406: C17.2 83.15,48 U$11.3 84.95,44.45 86.4,43 CN1.2